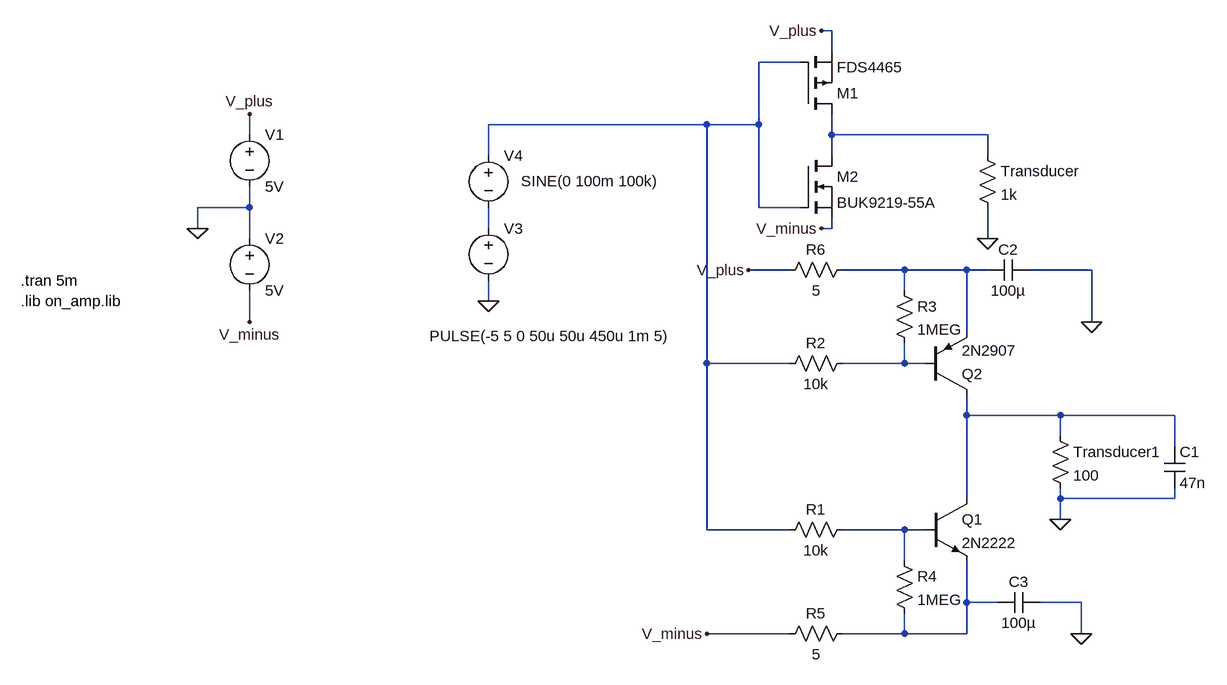
[diagram p0: schematic push-pull_test.asc]
push-pull_test.asc, the LTspice schematic file:
Version 4
SHEET 1 880 924
WIRE -256 -64 -272 -64
WIRE -256 -32 -256 -64
WIRE -304 -16 -368 -16
WIRE -448 80 -784 80
WIRE -368 80 -368 -16
WIRE -368 80 -448 80
WIRE -1152 96 -1152 64
WIRE -256 96 -256 64
WIRE -16 96 -256 96
WIRE -784 128 -784 80
WIRE -256 128 -256 96
WIRE -16 128 -16 96
WIRE -1152 208 -1152 176
WIRE -1152 208 -1232 208
WIRE -368 208 -368 80
WIRE -304 208 -368 208
WIRE -1232 240 -1232 208
WIRE -784 240 -784 208
WIRE -256 240 -256 224
WIRE -256 240 -272 240
WIRE -1152 256 -1152 208
WIRE -16 256 -16 208
WIRE -320 304 -384 304
WIRE -144 304 -240 304
WIRE -48 304 -144 304
WIRE -16 304 -48 304
WIRE 144 304 48 304
WIRE -144 336 -144 304
WIRE -784 352 -784 320
WIRE -1152 384 -1152 336
WIRE 144 384 144 304
WIRE -48 400 -48 304
WIRE -448 448 -448 80
WIRE -320 448 -448 448
WIRE -144 448 -144 416
WIRE -144 448 -240 448
WIRE -112 448 -144 448
WIRE -48 528 -48 496
WIRE 96 528 -48 528
WIRE 272 528 96 528
WIRE 96 560 96 528
WIRE 272 576 272 528
WIRE -48 656 -48 528
WIRE 96 656 96 640
WIRE 272 656 272 640
WIRE 272 656 96 656
WIRE 96 688 96 656
WIRE -448 704 -448 448
WIRE -320 704 -448 704
WIRE -144 704 -240 704
WIRE -112 704 -144 704
WIRE -144 752 -144 704
WIRE -48 816 -48 752
WIRE 0 816 -48 816
WIRE 128 816 64 816
WIRE -320 864 -448 864
WIRE -144 864 -144 832
WIRE -144 864 -240 864
WIRE -48 864 -48 816
WIRE -48 864 -144 864
WIRE 128 864 128 816
FLAG -1232 240 0
FLAG -1152 64 V_plus
FLAG -1152 384 V_minus
FLAG -784 352 0
FLAG -272 240 V_minus
FLAG -272 -64 V_plus
FLAG -16 256 0
FLAG -384 304 V_plus
FLAG -448 864 V_minus
FLAG 96 688 0
FLAG 128 864 0
FLAG 144 384 0
SYMBOL voltage -1152 80 R0
WINDOW 123 0 0 Left 0
WINDOW 39 0 0 Left 0
SYMATTR InstName V1
SYMATTR Value 5V
SYMBOL voltage -1152 240 R0
WINDOW 123 0 0 Left 0
WINDOW 39 0 0 Left 0
SYMATTR InstName V2
SYMATTR Value 5V
SYMBOL voltage -784 224 R0
WINDOW 123 0 0 Left 0
WINDOW 39 0 0 Left 0
WINDOW 3 -91 182 Left 0
SYMATTR Value PULSE(-5 5 0 50u 50u 450u 1m 5)
SYMATTR InstName V3
SYMBOL res -32 112 R0
SYMATTR InstName Transducer
SYMATTR Value 1k
SYMBOL pmos -304 64 M180
SYMATTR InstName M1
SYMATTR Value FDS4465
SYMBOL nmos -304 128 R0
SYMATTR InstName M2
SYMATTR Value BUK9219-55A
SYMBOL npn -112 656 R0
SYMATTR InstName Q1
SYMATTR Value 2N2222
SYMBOL pnp -112 496 M180
SYMATTR InstName Q2
SYMATTR Value 2N2907
SYMBOL res 80 544 R0
SYMATTR InstName Transducer1
SYMATTR Value 100
SYMBOL voltage -784 112 R0
WINDOW 123 0 0 Left 0
WINDOW 39 0 0 Left 0
WINDOW 3 50 55 Left 0
SYMATTR Value SINE(0 100m 100k)
SYMATTR InstName V4
SYMBOL res -224 688 R90
WINDOW 0 0 56 VBottom 0
WINDOW 3 32 56 VTop 0
SYMATTR InstName R1
SYMATTR Value 10k
SYMBOL res -224 432 R90
WINDOW 0 0 56 VBottom 0
WINDOW 3 32 56 VTop 0
SYMATTR InstName R2
SYMATTR Value 10k
SYMBOL res -160 320 R0
SYMATTR InstName R3
SYMATTR Value 1MEG
SYMBOL res -160 736 R0
SYMATTR InstName R4
SYMATTR Value 1MEG
SYMBOL cap 256 576 R0
SYMATTR InstName C1
SYMATTR Value 47n
SYMBOL res -224 848 R90
WINDOW 0 0 56 VBottom 0
WINDOW 3 32 56 VTop 0
SYMATTR InstName R5
SYMATTR Value 5
SYMBOL res -224 288 R90
WINDOW 0 0 56 VBottom 0
WINDOW 3 32 56 VTop 0
SYMATTR InstName R6
SYMATTR Value 5
SYMBOL cap 48 288 R90
WINDOW 0 0 32 VBottom 0
WINDOW 3 32 32 VTop 0
SYMATTR InstName C2
SYMATTR Value 100µ
SYMBOL cap 64 800 R90
WINDOW 0 0 32 VBottom 0
WINDOW 3 32 32 VTop 0
SYMATTR InstName C3
SYMATTR Value 100µ
TEXT -1504 352 Left 0 !.lib on_amp.lib
TEXT -1504 320 Left 0 !.tran 5m

The netlist it stands for:
* push-pull_test.asc
V1 V_plus 0 5V
V2 0 V_minus 5V
V3 N003 0 PULSE(-5 5 0 50u 50u 450u 1m 5)
R§Transducer N002 0 1k
M1 N002 N001 V_plus V_plus FDS4465
M2 N002 N001 V_minus V_minus BUK9219-55A
Q1 N006 N007 N008 0 2N2222
Q2 N006 N005 N004 0 2N2907
R§Transducer1 N006 0 100
V4 N001 N003 SINE(0 100m 100k)
R1 N007 N001 10k
R2 N005 N001 10k
R3 N004 N005 1MEG
R4 N007 N008 1MEG
C1 N006 0 47n
R5 N008 V_minus 5
R6 N004 V_plus 5
C2 0 N004 100µ
C3 0 N008 100µ
.model NPN NPN
.model PNP PNP
.lib standard.bjt
.model NMOS NMOS
.model PMOS PMOS
.lib standard.mos
.lib on_amp.lib
.tran 5m
.backanno
.end